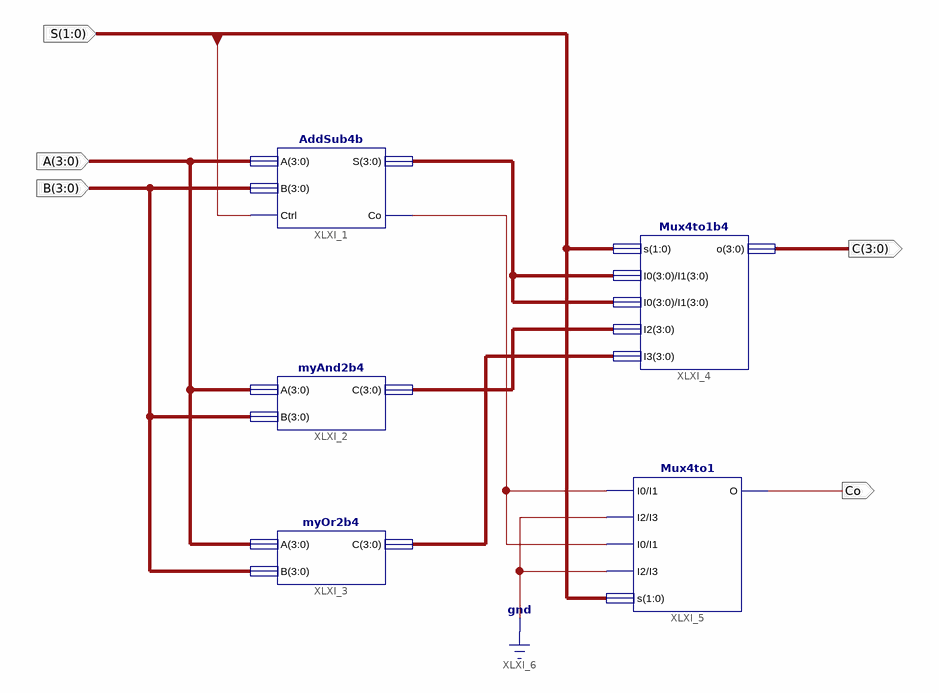
[diagram p0: schematic sheet 1]
// Xilinx ISE schematic ALU.sch (kintex7) as structural Verilog: 5 symbols, 5 ports
module ALU (
  input  [1:0] S,
  input  [3:0] A,
  input  [3:0] B,
  output [3:0] C,
  output Co
);

  wire XLXN_14;
  wire [3:0] XLXN_2, XLXN_3, XLXN_4;

  AddSub4b XLXI_1 (.A(A), .B(B), .Ctrl(S[0]), .S(XLXN_2), .Co(XLXN_14));
  myAnd2b4 XLXI_2 (.A(A), .B(B), .C(XLXN_3));
  myOr2b4 XLXI_3 (.A(A), .B(B), .C(XLXN_4));
  Mux4to1b4 XLXI_4 (.s(S), .I0(XLXN_2), .I1(XLXN_2), .I2(XLXN_3), .I3(XLXN_4), .o(C));
  Mux4to1 XLXI_5 (.I0(XLXN_14), .I2(1'b0), .I1(XLXN_14), .I3(1'b0), .s(S), .O(Co));
endmodule
